# Altium schematic sheet Master.SchDoc
size A4; SheetNumber: 1; SheetTotal: 7
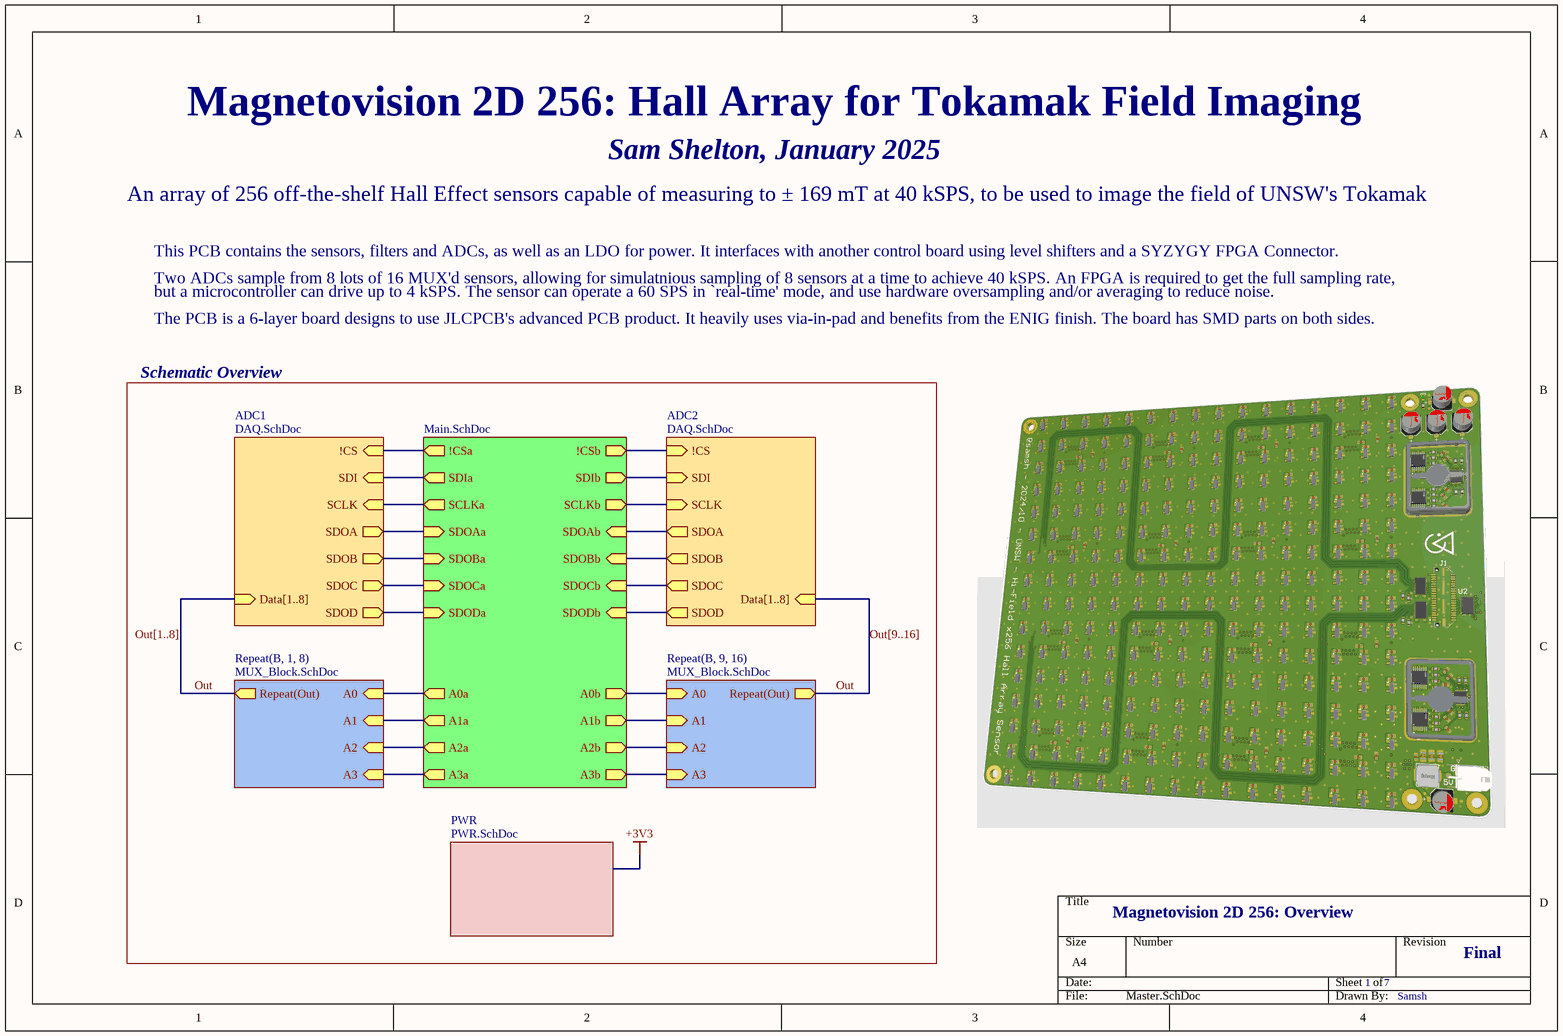
[diagram p0: Master.SchDoc]

## Sub-sheets
ADC1 = DAQ.SchDoc: Data[1..8] (in), !CS (in), SDOA (out), SDI (in), SCLK (in), SDOB (out), SDOC (out), SDOD (out)
ADC2 = DAQ.SchDoc: Data[1..8] (in), !CS (in), SDOA (out), SDI (in), SCLK (in), SDOB (out), SDOC (out), SDOD (out)
PWR = PWR.SchDoc: no entries
Repeat(B, 1, 8) = MUX_Block.SchDoc: A0 (in), A1 (in), A2 (in), A3 (in), Repeat(Out) (out)
Repeat(B, 9, 16) = MUX_Block.SchDoc: A0 (in), A1 (in), A2 (in), A3 (in), Repeat(Out) (out)
? = Main.SchDoc: SDOAa (in), SDIa (out), !CSa (out), !CSb (out), SDOBa (in), A0a (out), A1a (out), A2a (out), A3a (out), A0b (out), A1b (out), A2b (out), A3b (out), SDOCa (in), SDODa (in), SCLKa (out), SDOAb (in), SDIb (out), SDOBb (in), SDOCb (in), SDODb (in), SCLKb (out)

## Nets
Out: sheet Repeat(B, 1, 8)/Repeat(Out), sheet Repeat(B, 9, 16)/Repeat(Out)
(unnamed): sheet ADC1/!CS, sheet /!CSa
(unnamed): sheet ADC1/SDOA, sheet /SDOAa
(unnamed): sheet ADC1/SDI, sheet /SDIa
(unnamed): sheet ADC1/SCLK, sheet /SCLKa
(unnamed): sheet ADC1/SDOB, sheet /SDOBa
(unnamed): sheet ADC1/SDOC, sheet /SDOCa
(unnamed): sheet ADC1/SDOD, sheet /SDODa
(unnamed): sheet /!CSb, sheet ADC2/!CS
(unnamed): sheet /A0a, sheet Repeat(B, 1, 8)/A0
(unnamed): sheet /A1a, sheet Repeat(B, 1, 8)/A1
(unnamed): sheet /A2a, sheet Repeat(B, 1, 8)/A2
(unnamed): sheet /A3a, sheet Repeat(B, 1, 8)/A3
(unnamed): sheet /A0b, sheet Repeat(B, 9, 16)/A0
(unnamed): sheet /A1b, sheet Repeat(B, 9, 16)/A1
(unnamed): sheet /A2b, sheet Repeat(B, 9, 16)/A2
(unnamed): sheet /A3b, sheet Repeat(B, 9, 16)/A3
(unnamed): sheet /SDOAb, sheet ADC2/SDOA
(unnamed): sheet /SDIb, sheet ADC2/SDI
(unnamed): sheet /SDOBb, sheet ADC2/SDOB
(unnamed): sheet /SDOCb, sheet ADC2/SDOC
(unnamed): sheet /SDODb, sheet ADC2/SDOD
(unnamed): sheet /SCLKb, sheet ADC2/SCLK

## Buses and harness runs
bus Out[1..8] = sheet ADC1/Data[1..8]
bus Out[9..16] = sheet ADC2/Data[1..8]

## Notes on the sheet
- Magnetovision 2D 256: Hall Array for Tokamak Field Imaging
- Sam Shelton, January 2025
- An array of 256 off-the-shelf Hall Effect sensors capable of measuring to ± 169 mT at 40 kSPS, to be used to image the field of UNSW's Tokamak
- This PCB contains the sensors, filters and ADCs, as well as an LDO for power. It interfaces with another control board using level shifters and a SYZYGY FPGA Connector.
- Two ADCs sample from 8 lots of 16 MUX'd sensors, allowing for simulatnious sampling of 8 sensors at a time to achieve 40 kSPS. An FPGA is required to get the full sampling rate,
- but a microcontroller can drive up to 4 kSPS. The sensor can operate a 60 SPS in `real-time' mode, and use hardware oversampling and/or averaging to reduce noise.
- Schematic Overview
- The PCB is a 6-layer board designs to use JLCPCB's advanced PCB product. It heavily uses via-in-pad and benefits from the ENIG finish. The board has SMD parts on both sides.
- Magnetovision 2D 256: Overview
- 1
- 7
- Final
- Samsh